# EAGLE design tritiled22_cr2354_lux_c_reverse (EAGLE 8.2.2)
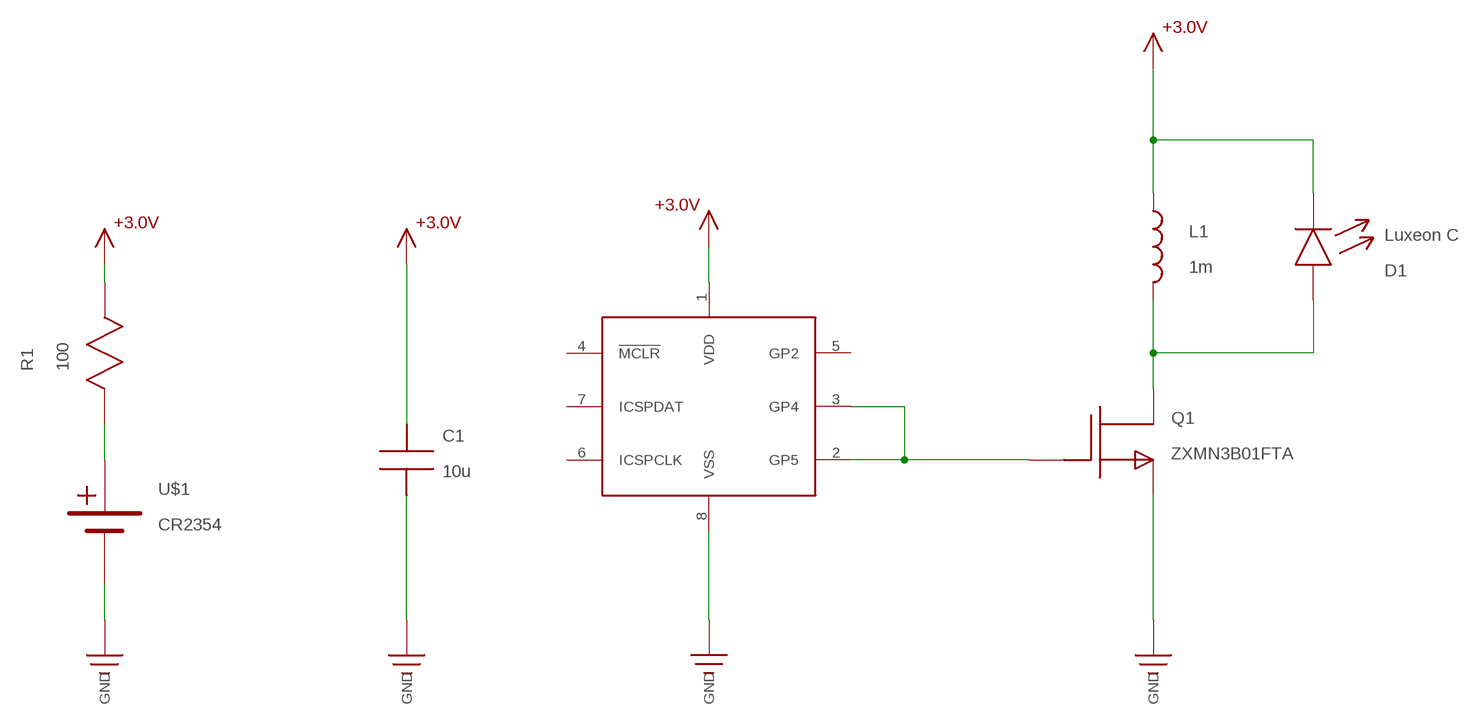
[diagram p0: schematic, sheet 1]

## Parts
C1  10u  C1206  [1206]
D1  Luxeon C  LEDLUXEON_C  [LUXEON_C]
L1  1m  SRR6028_INDUCTOR  [SRR6028_INDUCTOR]
Q1  ZXMN3B01FTA  ZXMN3B01FSOT23  [SOT-23]
R1  100  R1206  [R1206]
U1  PIC12LF1571  [SOIC8]
U$1  CR2354  CR2354_TABBED  [CR2354_TABBED]

## Nets
+3.3V: C1.P$1 D1.C L1.P$1 R1.P$2 U1.1(VDD) ; supply symbol labelled +3.0V
GND: C1.P$2 Q1.2(S) U1.8(VSS) U$1.GND(0V)
N$5: D1.A L1.P$2 Q1.3(D)
N$8: Q1.1(G) U1.2(GP5) U1.3(GP4)
VBATT: R1.P$1 U$1.+3V(+V)
Unconnected: U1.4(!MCLR!) U1.5(GP2) U1.6(ICSPCLK) U1.7(ICSPDAT)

## Library data of the parts
C1 = tritiled:C
D1 = tritiled:LED
L1 = tritiled:SRR6028_INDUCTOR
Q1 = tritiled:ZXMN3B01F
R1 = tritiled:R
U1 = tritiled:PIC12LF1571
U$1 = tritiled:CR2354_TABBED

## Board
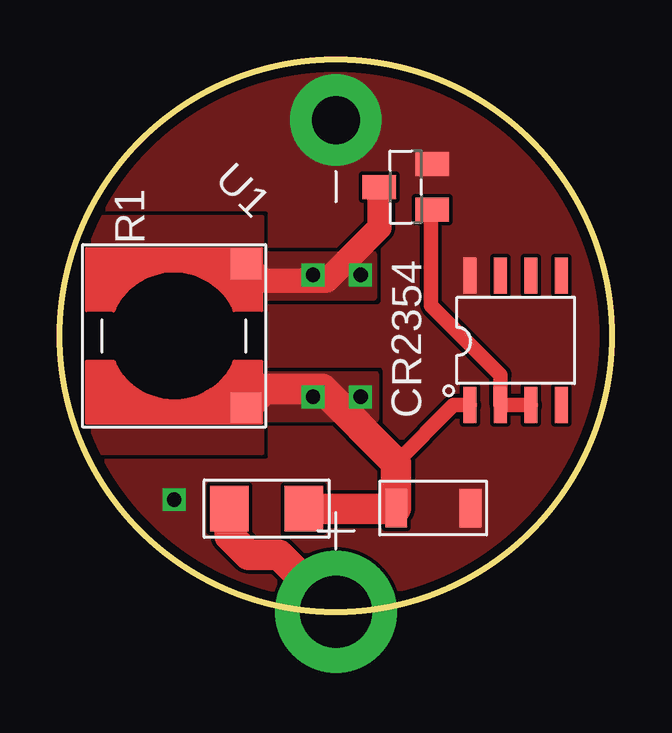
[diagram p1: board, top side]
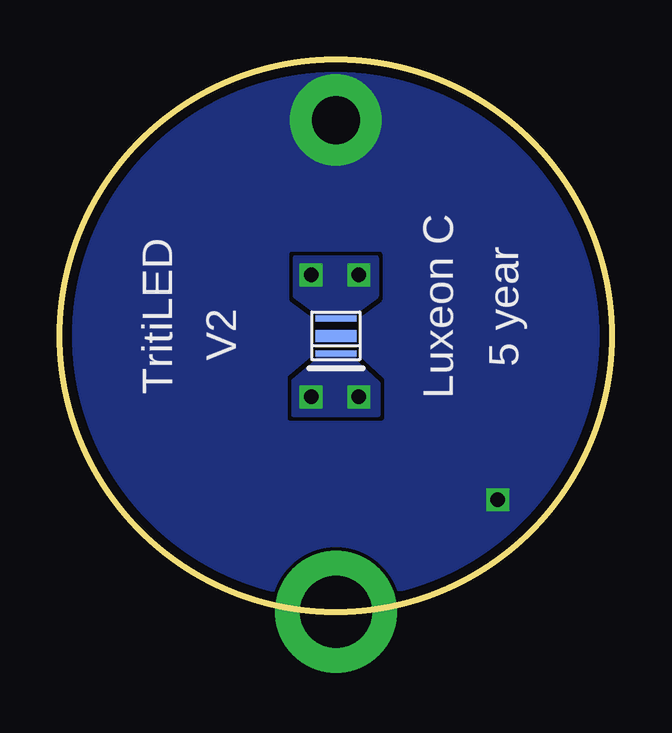
[diagram p2: board, bottom side, seen from below]

Size 23.01 x 23.01 mm. Coordinates in mm from the lower left corner, seen from the top.
Outline: circle at 11.51,11.51 radius 11.51
Copper layers (1*16): Top 0.0356mm / dielectric 1.5011mm / Bottom 0.0356mm
Design rules "LaenPCBOrder_tented_vias": minimum track width 6mil, minimum drill 13mil, track to track 6mil, track to pad 6mil, pad to pad 6mil, via to via 6mil, smd to smd 6mil, copper to edge 15mil, drill to drill 6mil, minimum pad ring 7mil, minimum via ring 7mil, stop-mask expansion 3mil, vias tented up to drill 16mil, thermal gap 10mil

### Footprints (pad centres in the part's own frame; a part is rotated, then mirrored left to right if it is on the bottom)
1206 = smd 0.9 x 1.6: P$1 -1.55,0; P$2 1.55,0
LUXEON_C = smd 0.25 x 1.7: A -0.725,0; C 0.725,0 | smd 0.5 x 1.7: HS 0,0
SRR6028_INDUCTOR = smd 1.27 x 1.27: P$1 -3,3; P$2 -3,-3
SOT-23 = smd 1 x 1.4: 1 -0.95,-1.1; 2 0.95,-1.1; 3 0,1.1
R1206 = smd 1.6 x 1.9: P$1 -1.55,0; P$2 1.55,0
SOIC8 = smd 0.55 x 1.5: 1 -1.905,-2.7; 2 -0.635,-2.7; 3 0.635,-2.7; 4 1.905,-2.7; 5 1.905,2.7; 6 0.635,2.7; 7 -0.635,2.7; 8 -1.905,2.7
CR2354_TABBED = drill 3 pad 5.08: +3V 0,-11.5 | drill 2 pad 3.81: GND 0,9

### Placement (x,y rotation side)
C1  15.56,4.33 0 top
D1  11.51,11.51 270 bottom
L1  4.76,11.51 180 top
Q1  14.41,17.72 90 top
R1  8.61,4.3 0 top
U1  19,11.32 0 top
U$1  11.51,11.51 0 top

### Tracks (layer width: path | path; a pad name or v marks a point on that pad's centre or on a via)
+3.3V  (via drill 0.6)
  Top 0.61: U1.1 16.42,8.62 14.01,6.22
  Top 1.27: R1.P$2 13.99,4.3 C1.P$1 14.01,6.22 10.95,9.28 8.54,9.28 L1.P$1
  other vias: 10.55,8.97 12.54,8.97
  pour Top (no thermals): 6.11,8.01 10.24,9.6 10.25,9.61
  pour Bottom (no thermals): 10.79,10.71 12.22,10.71 12.22,10.47 13.25,9.6 13.25,8.25 9.76,8.25 9.76,9.52 10.79,10.47
  pour Top (no thermals): 8.33,9.92 13.17,9.92 13.17,8.01 8.33,8.01
  pour Top (no thermals): 1.11,6.66 8.41,6.66 8.41,8.09 1.11,8.09
GND  (via drill 0.6)
  other vias: 4.76,4.68
  pour Bottom (rank 2, no thermals): -3.1,-3.1 26.75,-3.1 26.75,26.11 -3.1,26.11
  pour Top (rank 2, no thermals): -3.1,-3.1 26.75,-3.1 26.75,26.11 -3.1,26.11
N$5  (via drill 0.6)
  Top 1.016: Q1.3 13.31,16.01 11.11,13.81 8.46,13.81 L1.P$2
  other vias: 10.55,14.05 12.54,14.05
  pour Bottom (no thermals): 10.79,12.3 12.22,12.3 12.22,12.46 13.17,13.17 13.17,14.76 9.84,14.76 9.84,13.17 10.79,12.46
  pour Top (no thermals): 7.93,14.92 13.09,14.92 13.09,13.09 7.93,13.09
  pour Top (no thermals): 1.11,15 8.41,15 8.41,16.43 1.11,16.43
N$8
  Top 0.61: U1.3 U1.2 18.37,9.88 15.48,12.78 15.48,16.73 Q1.1
VBATT
  Top 1.27: R1.P$1 7.06,3.17 7.86,2.38 9.13,2.38 U$1.+3V

### Text on the board
tPlace: CR2354
bPlace: Luxeon C | TritiLED | 5 year | V2